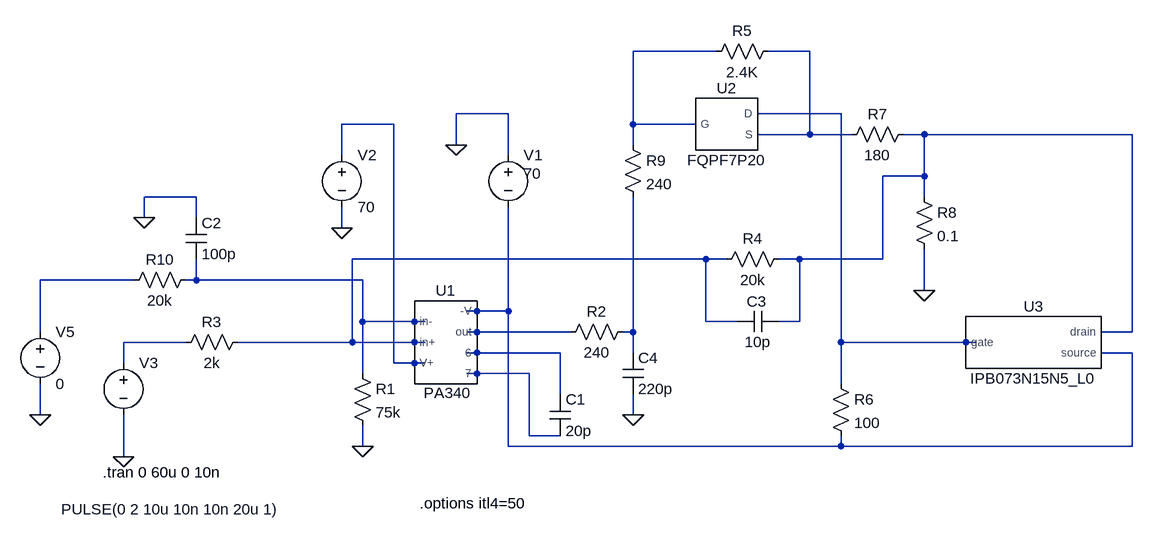
[diagram p0: schematic Draft11.asc]
Draft11.asc, the LTspice schematic file:
Version 4
SHEET 1 1672 680
WIRE 608 -288 480 -288
WIRE 752 -288 688 -288
WIRE 288 -192 208 -192
WIRE 800 -192 672 -192
WIRE 112 -176 32 -176
WIRE 480 -176 480 -288
WIRE 576 -176 480 -176
WIRE 752 -160 752 -288
WIRE 752 -160 672 -160
WIRE 816 -160 752 -160
WIRE 928 -160 896 -160
WIRE 1248 -160 928 -160
WIRE 208 -144 208 -192
WIRE 480 -144 480 -176
WIRE 32 -128 32 -176
WIRE 288 -128 288 -192
WIRE 928 -96 928 -160
WIRE 928 -96 864 -96
WIRE -192 -64 -272 -64
WIRE 928 -64 928 -96
WIRE -272 -32 -272 -64
WIRE -192 -32 -192 -64
WIRE 32 -16 32 -48
WIRE 592 32 48 32
WIRE 624 32 592 32
WIRE 736 32 704 32
WIRE 864 32 864 -96
WIRE 864 32 736 32
WIRE -288 64 -432 64
WIRE -192 64 -192 32
WIRE -192 64 -208 64
WIRE 64 64 -192 64
WIRE 928 80 928 16
WIRE 288 112 288 -48
WIRE 288 112 224 112
WIRE 64 128 64 64
WIRE 160 128 64 128
WIRE 592 128 592 32
WIRE 640 128 592 128
WIRE 736 128 736 32
WIRE 736 128 704 128
WIRE -432 144 -432 64
WIRE 384 144 224 144
WIRE 480 144 480 -64
WIRE 480 144 464 144
WIRE 1248 144 1248 -160
WIRE 1248 144 1200 144
WIRE -208 160 -304 160
WIRE 48 160 48 32
WIRE 48 160 -128 160
WIRE 160 160 48 160
WIRE 800 160 800 -192
WIRE 992 160 800 160
WIRE 1008 160 992 160
WIRE 368 176 224 176
WIRE 480 176 480 144
WIRE 1248 176 1200 176
WIRE -304 192 -304 160
WIRE 112 192 112 -176
WIRE 160 192 112 192
WIRE 64 208 64 128
WIRE 320 208 224 208
WIRE 800 224 800 160
WIRE 368 240 368 176
WIRE -432 272 -432 224
WIRE 480 272 480 240
WIRE 320 304 320 208
WIRE 368 304 320 304
WIRE 64 320 64 288
WIRE 288 320 288 112
WIRE 800 320 800 304
WIRE 800 320 288 320
WIRE 1248 320 1248 176
WIRE 1248 320 800 320
WIRE -304 336 -304 272
FLAG 32 -16 0
FLAG 208 -144 0
FLAG -304 336 0
FLAG 928 80 0
FLAG 480 272 0
FLAG -432 272 0
FLAG 64 320 0
FLAG -272 -32 0
SYMBOL PA340 192 160 R0
SYMATTR InstName U1
SYMBOL res 48 192 R0
SYMATTR InstName R1
SYMATTR Value 75k
SYMBOL res 480 128 R90
WINDOW 0 0 56 VBottom 2
WINDOW 3 32 56 VTop 2
SYMATTR InstName R2
SYMATTR Value 240
SYMBOL res -112 144 R90
WINDOW 0 0 56 VBottom 2
WINDOW 3 32 56 VTop 2
SYMATTR InstName R3
SYMATTR Value 2k
SYMBOL cap 352 240 R0
SYMATTR InstName C1
SYMATTR Value 20p
SYMBOL voltage 288 -144 R0
WINDOW 3 24 44 Left 2
WINDOW 123 0 0 Left 0
WINDOW 39 0 0 Left 0
SYMATTR Value 70
SYMATTR InstName V1
SYMBOL voltage 32 -144 R0
WINDOW 123 0 0 Left 0
WINDOW 39 0 0 Left 0
SYMATTR InstName V2
SYMATTR Value 70
SYMBOL voltage -304 176 R0
WINDOW 123 0 0 Left 0
WINDOW 39 0 0 Left 0
WINDOW 3 -96 241 Left 2
SYMATTR InstName V3
SYMATTR Value PULSE(0 2 10u 10n 10n 20u 1)
SYMBOL res 704 -304 R90
WINDOW 0 0 56 VBottom 2
WINDOW 3 32 56 VTop 2
SYMATTR InstName R5
SYMATTR Value 2.4K
SYMBOL res 912 -176 R90
WINDOW 0 0 56 VBottom 2
WINDOW 3 32 56 VTop 2
SYMATTR InstName R7
SYMATTR Value 180
SYMBOL res 912 -80 R0
SYMATTR InstName R8
SYMATTR Value 0.1
SYMBOL res 720 16 R90
WINDOW 0 0 56 VBottom 2
WINDOW 3 32 56 VTop 2
SYMATTR InstName R4
SYMATTR Value 20k
SYMBOL res 784 208 R0
SYMATTR InstName R6
SYMATTR Value 100
SYMBOL IPB073N15N5_L0 1088 160 R0
SYMATTR InstName U3
SYMBOL cap 704 112 R90
WINDOW 0 1 34 VBottom 2
WINDOW 3 32 32 VTop 2
SYMATTR InstName C3
SYMATTR Value 10p
SYMBOL FQPF7P20 624 -176 R0
SYMATTR InstName U2
SYMBOL cap 464 176 R0
SYMATTR InstName C4
SYMATTR Value 220p
SYMBOL res 464 -160 R0
SYMATTR InstName R9
SYMATTR Value 240
SYMBOL res -192 48 R90
WINDOW 0 0 56 VBottom 2
WINDOW 3 32 56 VTop 2
SYMATTR InstName R10
SYMATTR Value 20k
SYMBOL voltage -432 128 R0
WINDOW 123 0 0 Left 0
WINDOW 39 0 0 Left 0
SYMATTR InstName V5
SYMATTR Value 0
SYMBOL cap -208 -32 R0
SYMATTR InstName C2
SYMATTR Value 100p
TEXT -336 360 Left 2 !.tran 0 60u 0 10n
TEXT 152 408 Left 2 !.options itl4=50

The netlist it stands for:
* Draft11.asc
XU1 N006 N008 N004 N009 N010 N013 N014 PA340  ; pins in+ in- V+ -V out 6 7
R1 N008 0 75k
R2 N011 N010 240
R3 N006 N012 2k
C1 N013 N014 20p
V1 0 N009 70
V2 N004 0 70
V3 N012 0 PULSE(0 2 10u 10n 10n 20u 1)
R5 N002 N001 2.4K
R7 N005 N002 180
R8 N005 0 0.1
R4 N005 N006 20k
R6 N003 N009 100
XU3 N005 N003 N009 IPB073N15N5_L0  ; pins drain gate source
C3 N005 N006 10p
XU2 N003 N001 N002 FQPF7P20  ; pins D G S
C4 N011 0 220p
R9 N001 N011 240
R10 N008 N007 20k
V5 N007 0 0
C2 0 N008 100p
.tran 0 60u 0 10n
.options itl4=50
.lib ./PA340_Pspice.LIB
.lib .\IPB073N15N5.SUB
.lib ./FQPF7P20.lib
.backanno
.end